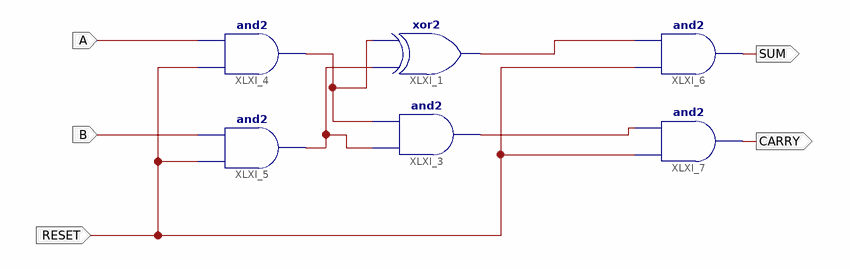
[diagram p0: schematic sheet 1]
// Xilinx ISE schematic HA.sch (artix7) as structural Verilog: 6 symbols, 5 ports
module HA (
  input  A,
  input  B,
  input  RESET,
  output CARRY,
  output SUM
);

  wire XLXN_2, XLXN_3, XLXN_11, XLXN_15;

  xor XLXI_1 (XLXN_2, XLXN_11, XLXN_15);
  and XLXI_3 (XLXN_3, XLXN_11, XLXN_15);
  and XLXI_4 (XLXN_15, RESET, A);
  and XLXI_5 (XLXN_11, RESET, B);
  and XLXI_6 (SUM, RESET, XLXN_2);
  and XLXI_7 (CARRY, RESET, XLXN_3);
endmodule
